# Altium project Course6.PrjPcb
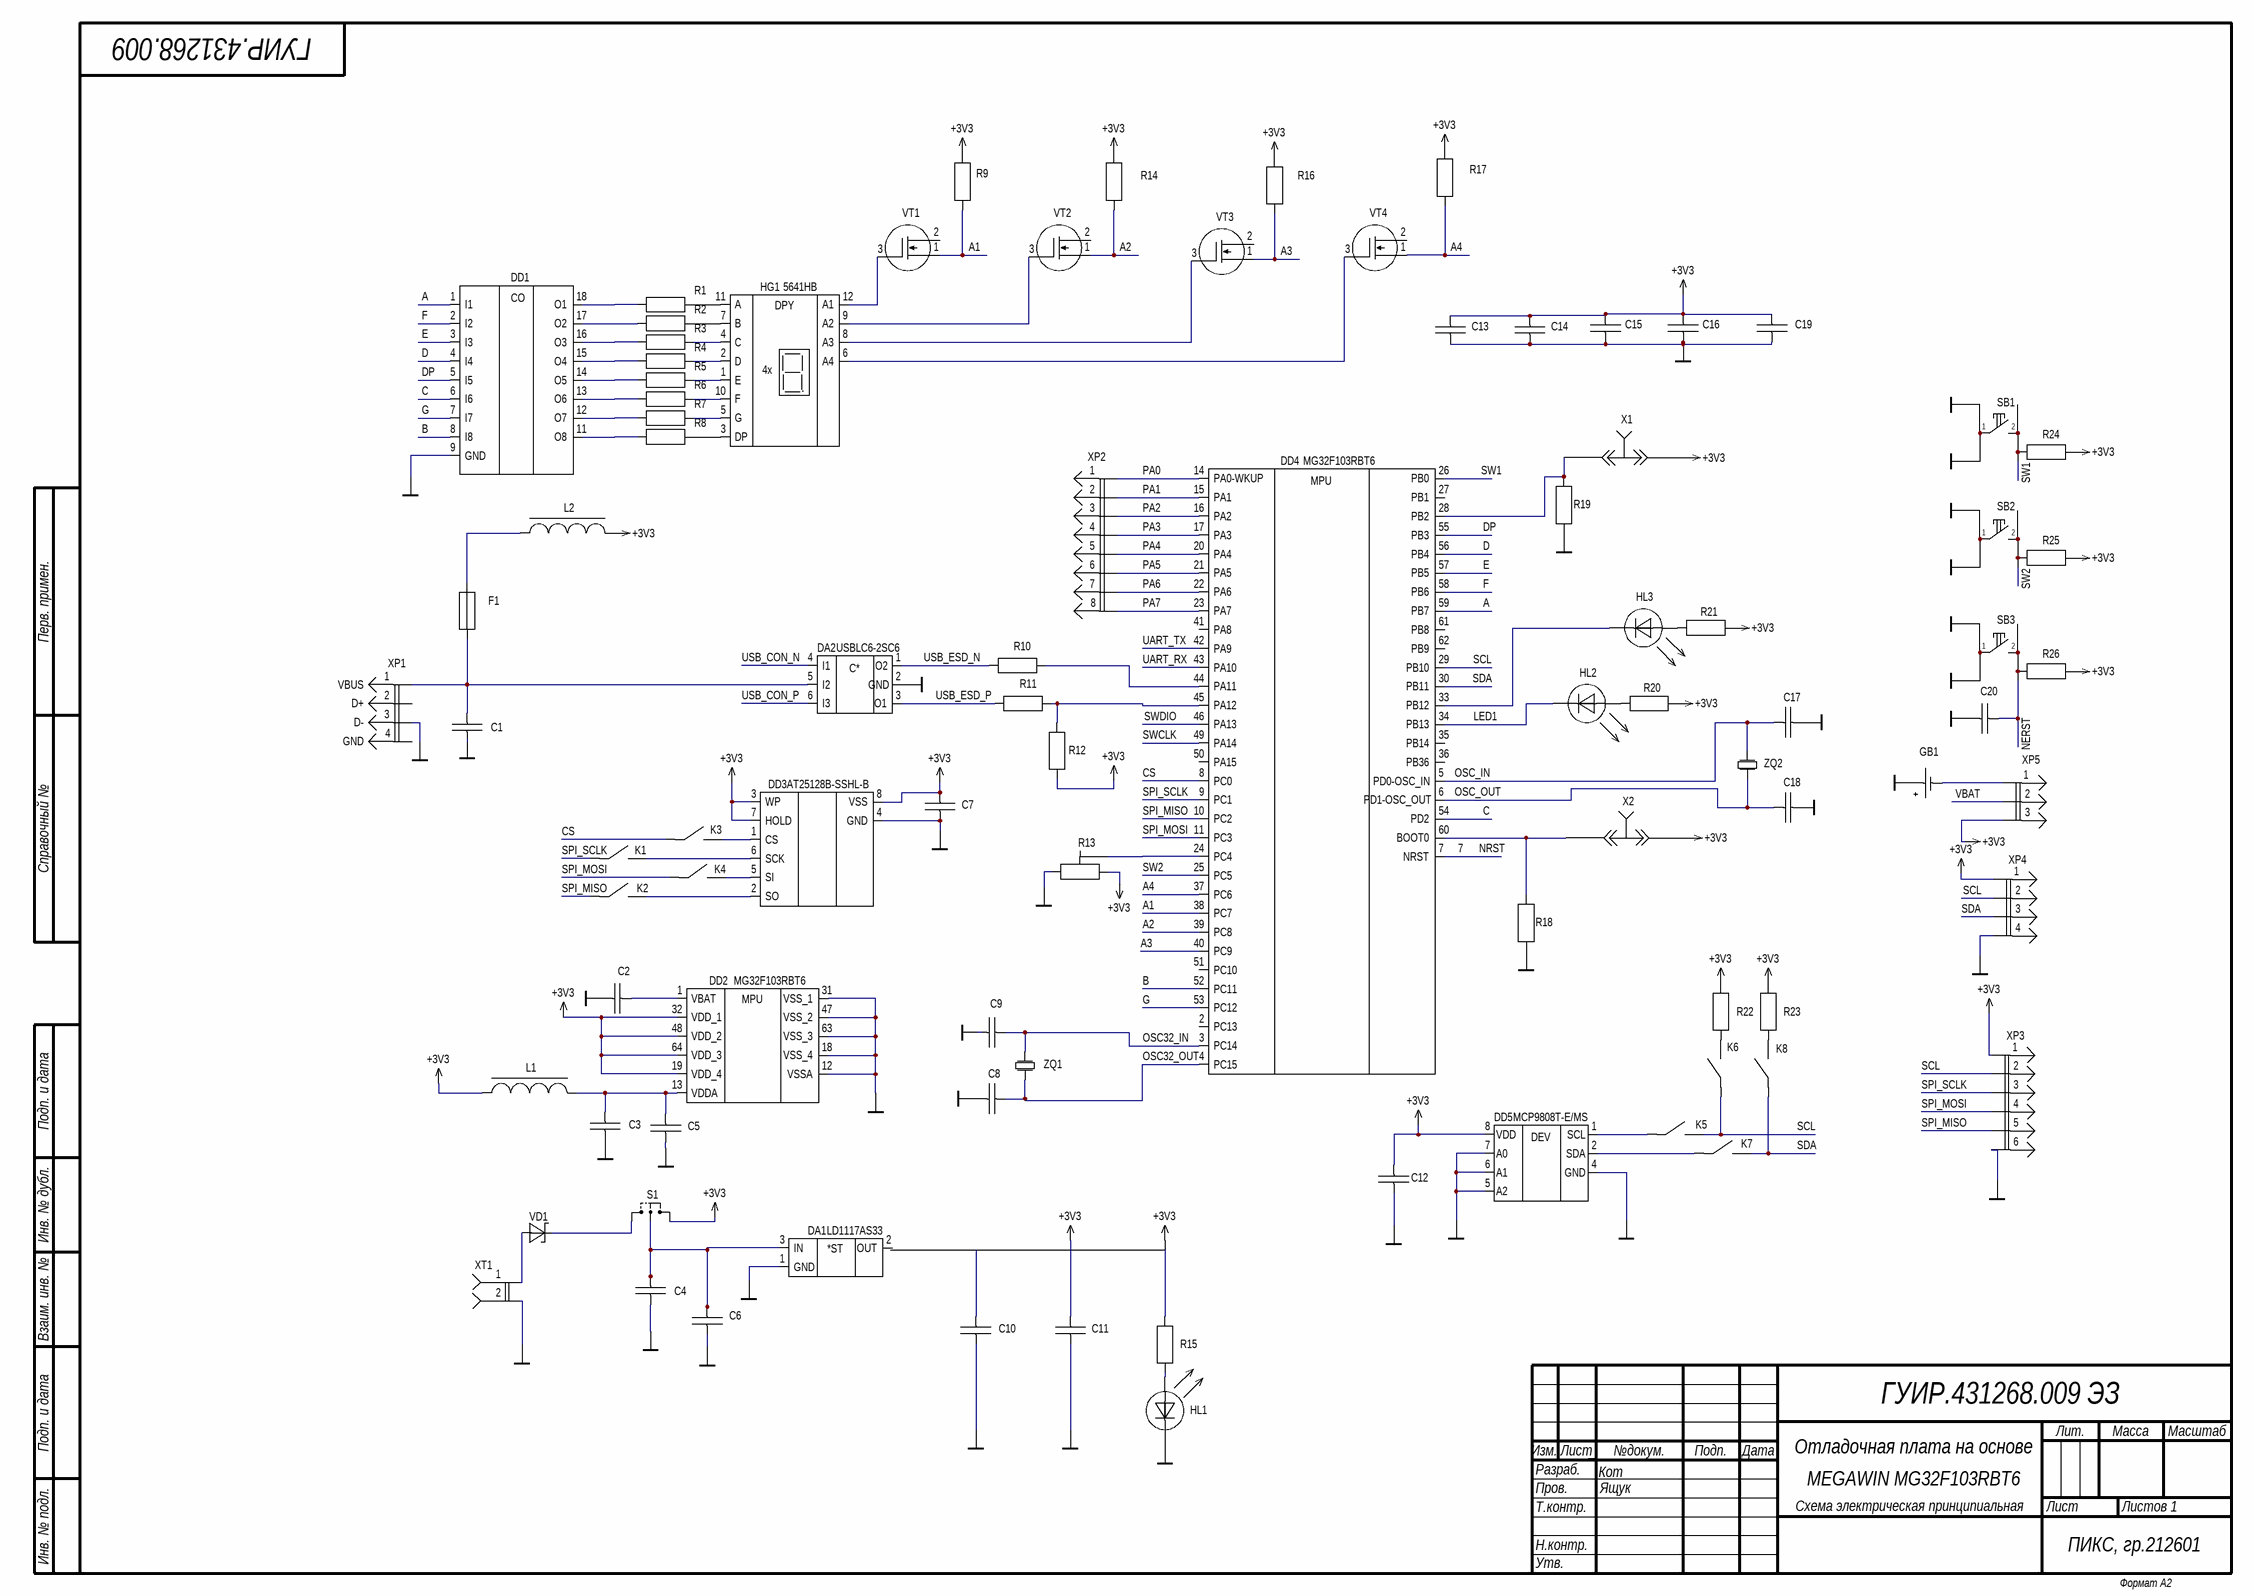
[diagram p0: Sheet1.SchDoc]
3 sheets, 88 parts. Net scope: global (net labels, ports and power ports of the same name join across sheets).
Sheets:
  Sheet1.SchDoc
  Sheet2.SchDoc
  Sheet3.SchDoc

## Sheet Sheet1.SchDoc
size 594 x 420 mm; SheetNumber: 1; SheetTotal: 3; _Oboznachenie: АБВГ.123456.789Э3; _Tip_dokumenta: Схема электрическая принципиальная; _Dopolnitelnye_grafy: -; DocumentName: Sheet1.SCHDOC

### Parts
C1  C  [C_0603]  (value not drawn)
C2  C  [C_0603]  (value not drawn)
C3  C  [C_0603]  (value not drawn)
C4  C  [C_0603]  (value not drawn)
C5  C  [C_0603]  (value not drawn)
C6  C  [C_0603]  (value not drawn)
C7  C  [C_0603]  (value not drawn)
C8  C  [C_0603]  (value not drawn)
C9  C  [C_0603]  (value not drawn)
C10  C  [C_0603]  (value not drawn)
C11  C  [C_0603]  (value not drawn)
C12  C  [C_0603]  (value not drawn)
C13  C  [C_0603]  (value not drawn)
C14  C  [C_0603]  (value not drawn)
C15  C  [C_0603]  (value not drawn)
C16  C  [C_0603]  (value not drawn)
C17  C  [C_0603]  (value not drawn)
C18  C  [C_0603]  (value not drawn)
C19  C  [C_0603]  (value not drawn)
C20  C  [C_0603]  (value not drawn)
DA1  LD1117AS33
DA2  USBLC6-2SC6
DD1  IC1  (value not drawn)
DD2  MG32F103RBT6
DD3  AT25128B-SSHL-B
DD4  MG32F103RBT6
DD5  MCP9808T-E/MS
F1  R_2_  (value not drawn)
GB1  С_pol  (value not drawn)
HG1  5641HB
HL1  H_LED  [LED]  (value not drawn)
HL2  H_LED  [LED]  (value not drawn)
HL3  H_LED  [LED]  (value not drawn)
K1  K  [RALAY 4PIN]  (value not drawn)
K2  K  [RALAY 4PIN]  (value not drawn)
K3  K  [RALAY 4PIN]  (value not drawn)
K4  K  [RALAY 4PIN]  (value not drawn)
K5  K  [RALAY 4PIN]  (value not drawn)
K6  K->  (value not drawn)
K7  K  [RALAY 4PIN]  (value not drawn)
K8  K->  (value not drawn)
L1  L_1  [C_0603]  (value not drawn)
L2  L_1  [C_0603]  (value not drawn)
R1  R  [R_0402]  (value not drawn)
R2  R  [R_0402]  (value not drawn)
R3  R  [R_0402]  (value not drawn)
R4  R  [R_0402]  (value not drawn)
R5  R  [R_0402]  (value not drawn)
R6  R  [R_0402]  (value not drawn)
R7  R  [R_0402]  (value not drawn)
R8  R  [R_0402]  (value not drawn)
R9  R  [R_0402]  (value not drawn)
R10  R  [R_0402]  (value not drawn)
R11  R  [R_0402]  (value not drawn)
R12  R  [R_0402]  (value not drawn)
R13  R-\  (value not drawn)
R14  R  [R_0402]  (value not drawn)
R15  R  [R_0402]  (value not drawn)
R16  R  [R_0402]  (value not drawn)
R17  R  [R_0402]  (value not drawn)
R18  R  [R_0402]  (value not drawn)
R19  R  [R_0402]  (value not drawn)
R20  R  [R_0402]  (value not drawn)
R21  R  [R_0402]  (value not drawn)
R22  R  [R_0402]  (value not drawn)
R23  R  [R_0402]  (value not drawn)
R24  R  [R_0402]  (value not drawn)
R25  R  [R_0402]  (value not drawn)
R26  R  [R_0402]  (value not drawn)
S1  S  (value not drawn)
SB1  SB  [Pushbutton Switch]  (value not drawn)
SB2  SB  [Pushbutton Switch]  (value not drawn)
SB3  SB  [Pushbutton Switch]  (value not drawn)
VD1  VD_SHOTKI  [DIODE]  (value not drawn)
VT1  BSS84  (value not drawn)
VT2  BSS84  (value not drawn)
VT3  BSS84  (value not drawn)
VT4  BSS84  (value not drawn)
X1  X  (value not drawn)
X2  X  (value not drawn)
XP1  J1  (value not drawn)
XP2  XP  (value not drawn)
XP3  SPI  (value not drawn)
XP4  XP4  (value not drawn)
XP5  XPP  (value not drawn)
XT1  XT_2  [3PIN CON]  (value not drawn)
ZQ1  Z  (value not drawn)
ZQ2  Z  (value not drawn)

### Nets
+3V3: C7.1 C11.2 C12.1 C13.1 C14.1 C15.1 C16.1 C19.1 DD2.19(VDD_4) DD2.32(VDD_1) DD2.48(VDD_2) DD2.64(VDD_3) DD3.3(WP) DD3.7(HOLD) DD3.8(VSS) DD5.8(VDD) L1.1 L2.2 R9.1 R12.1 R13.2 R14.1 R16.1 R17.1 R20.1 R21.1 R22.2 R23.2 R24.2 R25.2 R26.2 X1.1 X2.1 XP3.1(RES) XP4.1(RES) XP5.3(Общ.)
GND: C1.1 C3.2 C4.1 C5.2 C6.1 C7.2 C8.2 C9.2 C10.1 C11.1 C12.2 C13.2 C14.2 C15.2 C16.2 C17.2 C19.2 C20.1 DA1.1(GND) DA2.2(GND) DD1.9(GND) DD2.12(VSSA) DD2.18(VSS_4) DD2.31(VSS_1) DD2.47(VSS_2) DD2.63(VSS_3) DD3.4(GND) DD5.4(GND) DD5.5(A2) DD5.6(A1) DD5.7(A0) GB1.2 HL1.2(C) R13.1 R18.2 R19.2 SB1.1 SB2.1 SB3.1 XP1.3(D-) XP3.6(PGD) XP4.4(PGC) XT1.2
A: DD1.1(I1) DD4.59(PB7)
A1: DD4.38(PC7) R9.2 VT1.1
A2: DD4.39(PC8) R14.2 VT2.1
A3: DD4.40(PC9) R16.2 VT3.1
A4: DD4.37(PC6) R17.2 VT4.1
B: DD1.8(I8) DD4.52(PC11)
C: DD1.6(I6) DD4.54(PD2)
CS: DD4.8(PC0) K3.1
D: DD1.4(I4) DD4.56(PB4)
DP: DD1.5(I5) DD4.55(PB3)
E: DD1.3(I3) DD4.57(PB5)
F: DD1.2(I2) DD4.58(PB6)
G: DD1.7(I7) DD4.53(PC12)
LED1: DD4.34(PB13) HL2.2(C)
NERST: C20.2 R26.1 SB3.2
NRST: DD4.7(NRST)
OSC32_IN: C9.1 DD4.3(PC14) ZQ1.1(X1)
OSC32_OUT: C8.1 DD4.4(PC15) ZQ1.2(X2)
OSC_IN: C17.1 DD4.5(PD0-OSC_IN) ZQ2.2(X2)
OSC_OUT: C18.1 DD4.6(PD1-OSC_OUT) ZQ2.1(X1)
PA0: DD4.14(PA0-WKUP) XP2.1(PGD)
PA1: DD4.15(PA1) XP2.2(PGD)
PA2: DD4.16(PA2) XP2.3(PGD)
PA3: DD4.17(PA3) XP2.4(PGD)
PA4: DD4.20(PA4) XP2.5(PGC)
PA5: DD4.21(PA5) XP2.6(Общ.)
PA6: DD4.22(PA6) XP2.7(+5_B)
PA7: DD4.23(PA7) XP2.8(RES)
SCL: DD4.29(PB10) K5.2 K6.1 XP3.2(+5_B) XP4.2(+5_B)
SDA: DD4.30(PB11) K7.2 K8.1 XP4.3(Общ.)
SPI_MISO: DD4.10(PC2) K2.1 XP3.5(PGD)
SPI_MOSI: DD4.11(PC3) K4.1 XP3.4(PGC)
SPI_SCLK: DD4.9(PC1) K1.1 XP3.3(Общ.)
SW1: DD4.26(PB0) R24.1 SB1.2
SW2: DD4.25(PC5) R25.1 SB2.2
SWCLK: DD4.49(PA14)
SWDIO: DD4.46(PA13)
UART_RX: DD4.43(PA10)
UART_TX: DD4.42(PA9)
USB_CON_N: DA2.4(I1)
USB_CON_P: DA2.6(I3)
USB_ESD_N: DA2.1(O2) R10.2
USB_ESD_P: DA2.3(O1) R11.2
VBAT: XP5.2(+5_B)
NetC1_2: C1.2 DA2.5(I2) F1.1 XP1.1(VBUS)
NetC2_2: C2.2 DD2.1(VBAT)
NetC3_1: C3.1 C5.1 DD2.13(VDDA) L1.2
NetC4_2: C4.2 C6.2 DA1.3(IN)
NetDD1_11: DD1.11(O8) R8.1
NetDD1_12: DD1.12(O7) R7.1
NetDD1_13: DD1.13(O6) R6.1
NetDD1_14: DD1.14(O5) R5.1
NetDD1_15: DD1.15(O4) R4.1
NetDD1_16: DD1.16(O3) R3.1
NetDD1_17: DD1.17(O2) R2.1
NetDD1_18: DD1.18(O1) R1.1
NetDD3_1: DD3.1(CS) K3.2
NetDD3_2: DD3.2(SO) K2.2
NetDD3_5: DD3.5(SI) K4.2
NetDD3_6: DD3.6(SCK) K1.2
NetDD4_24: DD4.24(PC4) R13.2
NetDD4_28: DD4.28(PB2) R19.1 X1.1
NetDD4_33: DD4.33(PB12) HL3.2(C)
NetDD4_44: DD4.44(PA11) R10.1
NetDD4_45: DD4.45(PA12) R11.1 R12.2
NetDD4_60: DD4.60(BOOT0) R18.1 X2.1
NetDD5_1: DD5.1(SCL) K5.1
NetDD5_2: DD5.2(SDA) K7.1
NetF1_2: F1.2 L2.1
NetGB1_1: GB1.1 XP5.1(RES)
NetHG1_1: HG1.1(E) R5.2
NetHG1_2: HG1.2(D) R4.2
NetHG1_3: HG1.3(DP) R8.2
NetHG1_4: HG1.4(C) R3.2
NetHG1_5: HG1.5(G) R7.2
NetHG1_6: HG1.6(A4) VT4.3
NetHG1_7: HG1.7(B) R2.2
NetHG1_8: HG1.8(A3) VT3.3
NetHG1_9: HG1.9(A2) VT2.3
NetHG1_10: HG1.10(F) R6.2
NetHG1_11: HG1.11(A) R1.2
NetHG1_12: HG1.12(A1) VT1.3
NetHL1_1: HL1.1(A) R15.1
NetHL2_1: HL2.1(A) R20.2
NetHL3_1: HL3.1(A) R21.2
NetK6_2: K6.2 R22.1
NetK8_2: K8.2 R23.1
NetVD1_1: VD1.1 XT1.1

Not connected (* = marked no-connect by the designer): C2 1; C10 2; C18 2; DA1 2(OUT); DD4 2(PC13) 27(PB1) 35(PB14) 36(PB36) 41(PA8) 50(PA15) 51(PC10) 61(PB8) 62(PB9); R15 2; VD1 2; VT1 2; VT2 2; VT3 2; VT4 2; XP1 2(D+) 4(GND)

### Notes on the sheet
- (near DD1) CO
- (near DD4) 7
- (near DD2) MPU
- Labels drawn without touching a wire or pin: +3V3, GND
- ГУИР.431268.009
- Перв. примен.
- Справочный №
- Подп. и дата
- Инв. № дубл.
- Взаим. инв. №
- ГУИР.431268.009 ЭЗ
- Разраб.
- Изм.
- Лист
- Кот
- №докум.
- Подп.
- Дата
- Отладочная плата на основе
- Лит.
- Масса
- Масштаб
- Пров.
- Т.контр.
- Ящук
- Схема электрическая принципиальная
- MEGAWIN MG32F103RBT6
- Листов 1
- Инв. № подл.
- Н.контр.
- Утв.
- ПИКС, гр.212601
- Формат A2
- (in symbol LED) DPY; DPY / LED; 4x; .
- (in symbol U1) *ST
- (in symbol U2) Type @ to refer to a designator or a net; C*
- (in symbol U3) MPU /
- (in symbol U4) *T
- (in symbol U5) DEV

### Library data of the parts
C1-C20 = C: Конденсатор
DA1 = U1
DA2 = U2
DD2 = U3B
DD3 = U4
DD4 = U3
DD5 = U5
F1 = R_2_: Резистор
GB1 = С_pol: Конденсатор полярный
HG1 = LED
HL1-HL3 = H_LED: Диод
K1-K5 K7 = K: Реле
L1 L2 = L_1: Индуктивность с ферромагнетиком
R1-R12 R14-R26 = R: Резистор
R13 = R-\: Резистор (подстрооечный)
SB1-SB3 = SB: Кнопка
VD1 = VD_SHOTKI: Диод Шоттки
VT1-VT4 = Q
XP2 = PA
XT1 = XT_2: Соединение (розетка)
ZQ1 ZQ2 = Z: Резонатор кварцевый

## Sheet Sheet2.SchDoc
size 209 x 297 mm; SheetNumber: 2; SheetTotal: 3
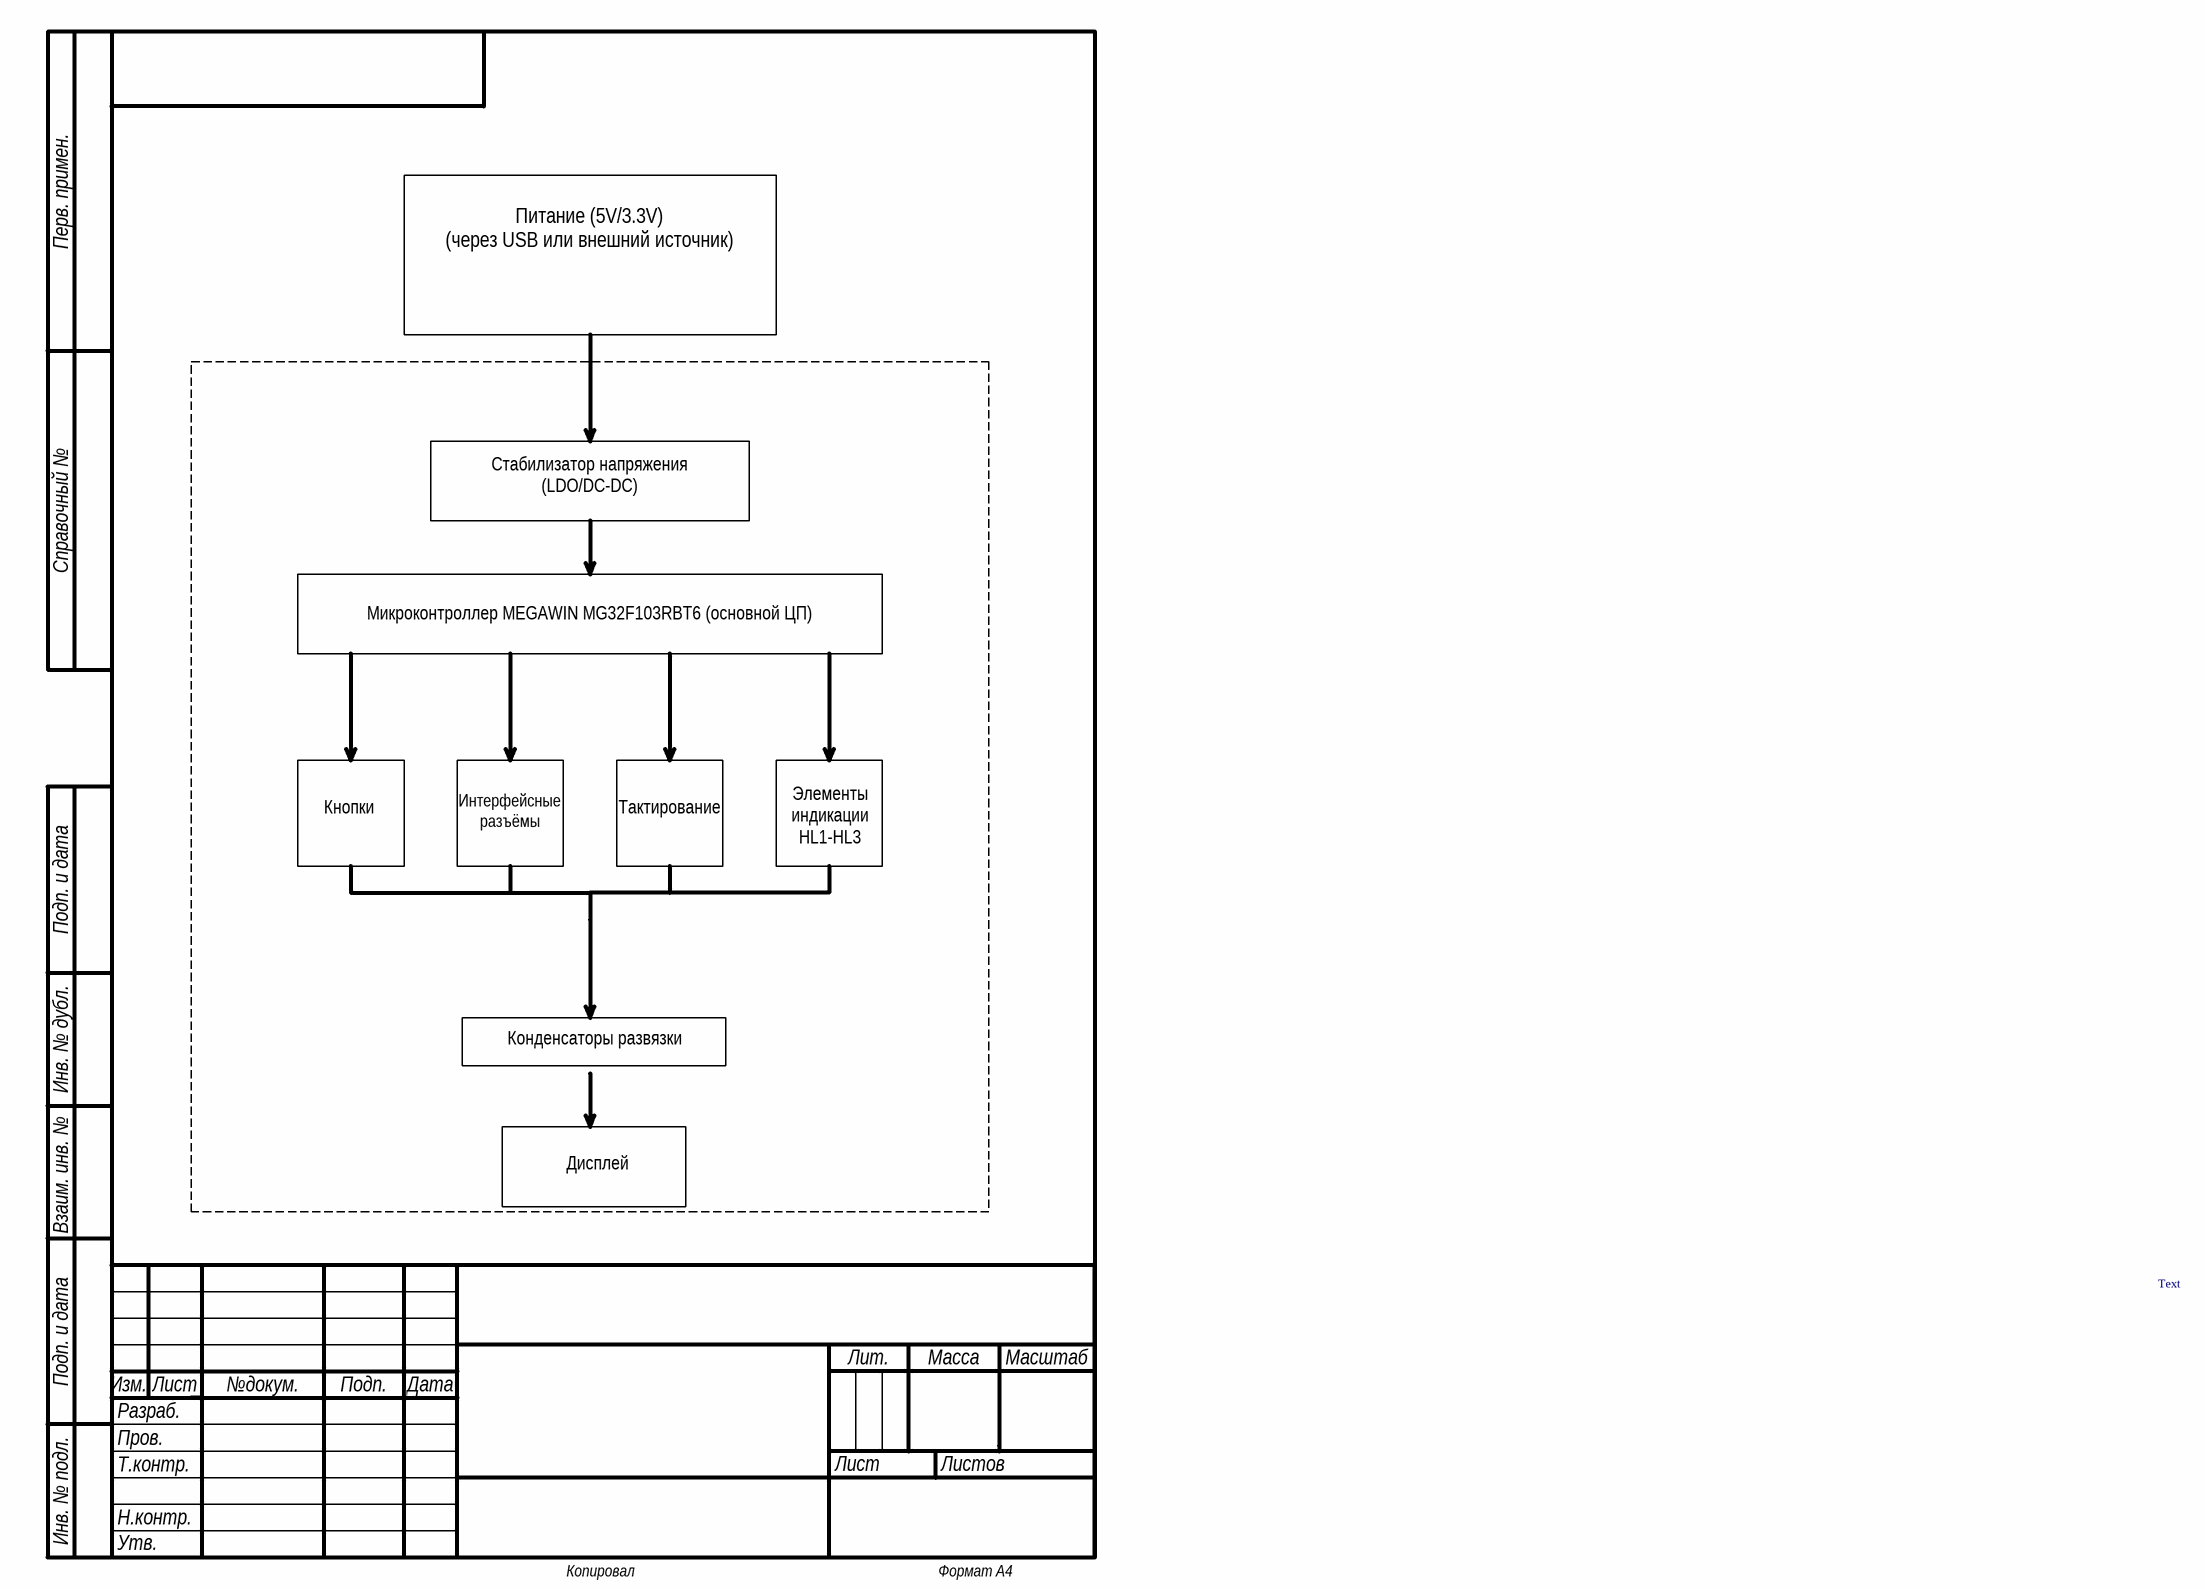
[diagram p1: Sheet2.SchDoc]

### Notes on the sheet
- Питание (5V/3.3V)                                                (через USB или внешний источник)
- Стабилизатор напряжения (LDO/DC-DC)
- Микроконтроллер MEGAWIN MG32F103RBT6 (основной ЦП)
- Кнопки
- Интерфейсные разъёмы
- Тактирование ZQ1, ZQ2
- Элементы индикации HL1-HL3
- Конденсаторы развязки
- Дисплей
- Text
- Перв. примен.
- Справочный №
- Подп. и дата
- Инв. № дубл.
- Взаим. инв. №
- Разраб.
- Изм.
- Лист
- №докум.
- Подп.
- Дата
- Лит.
- Масса
- Масштаб
- Пров.
- Т.контр.
- Листов
- Инв. № подл.
- Н.контр.
- Утв.
- Копировал
- Формат A4

## Sheet Sheet3.SchDoc
size 209 x 297 mm; SheetNumber: 3; SheetTotal: 3
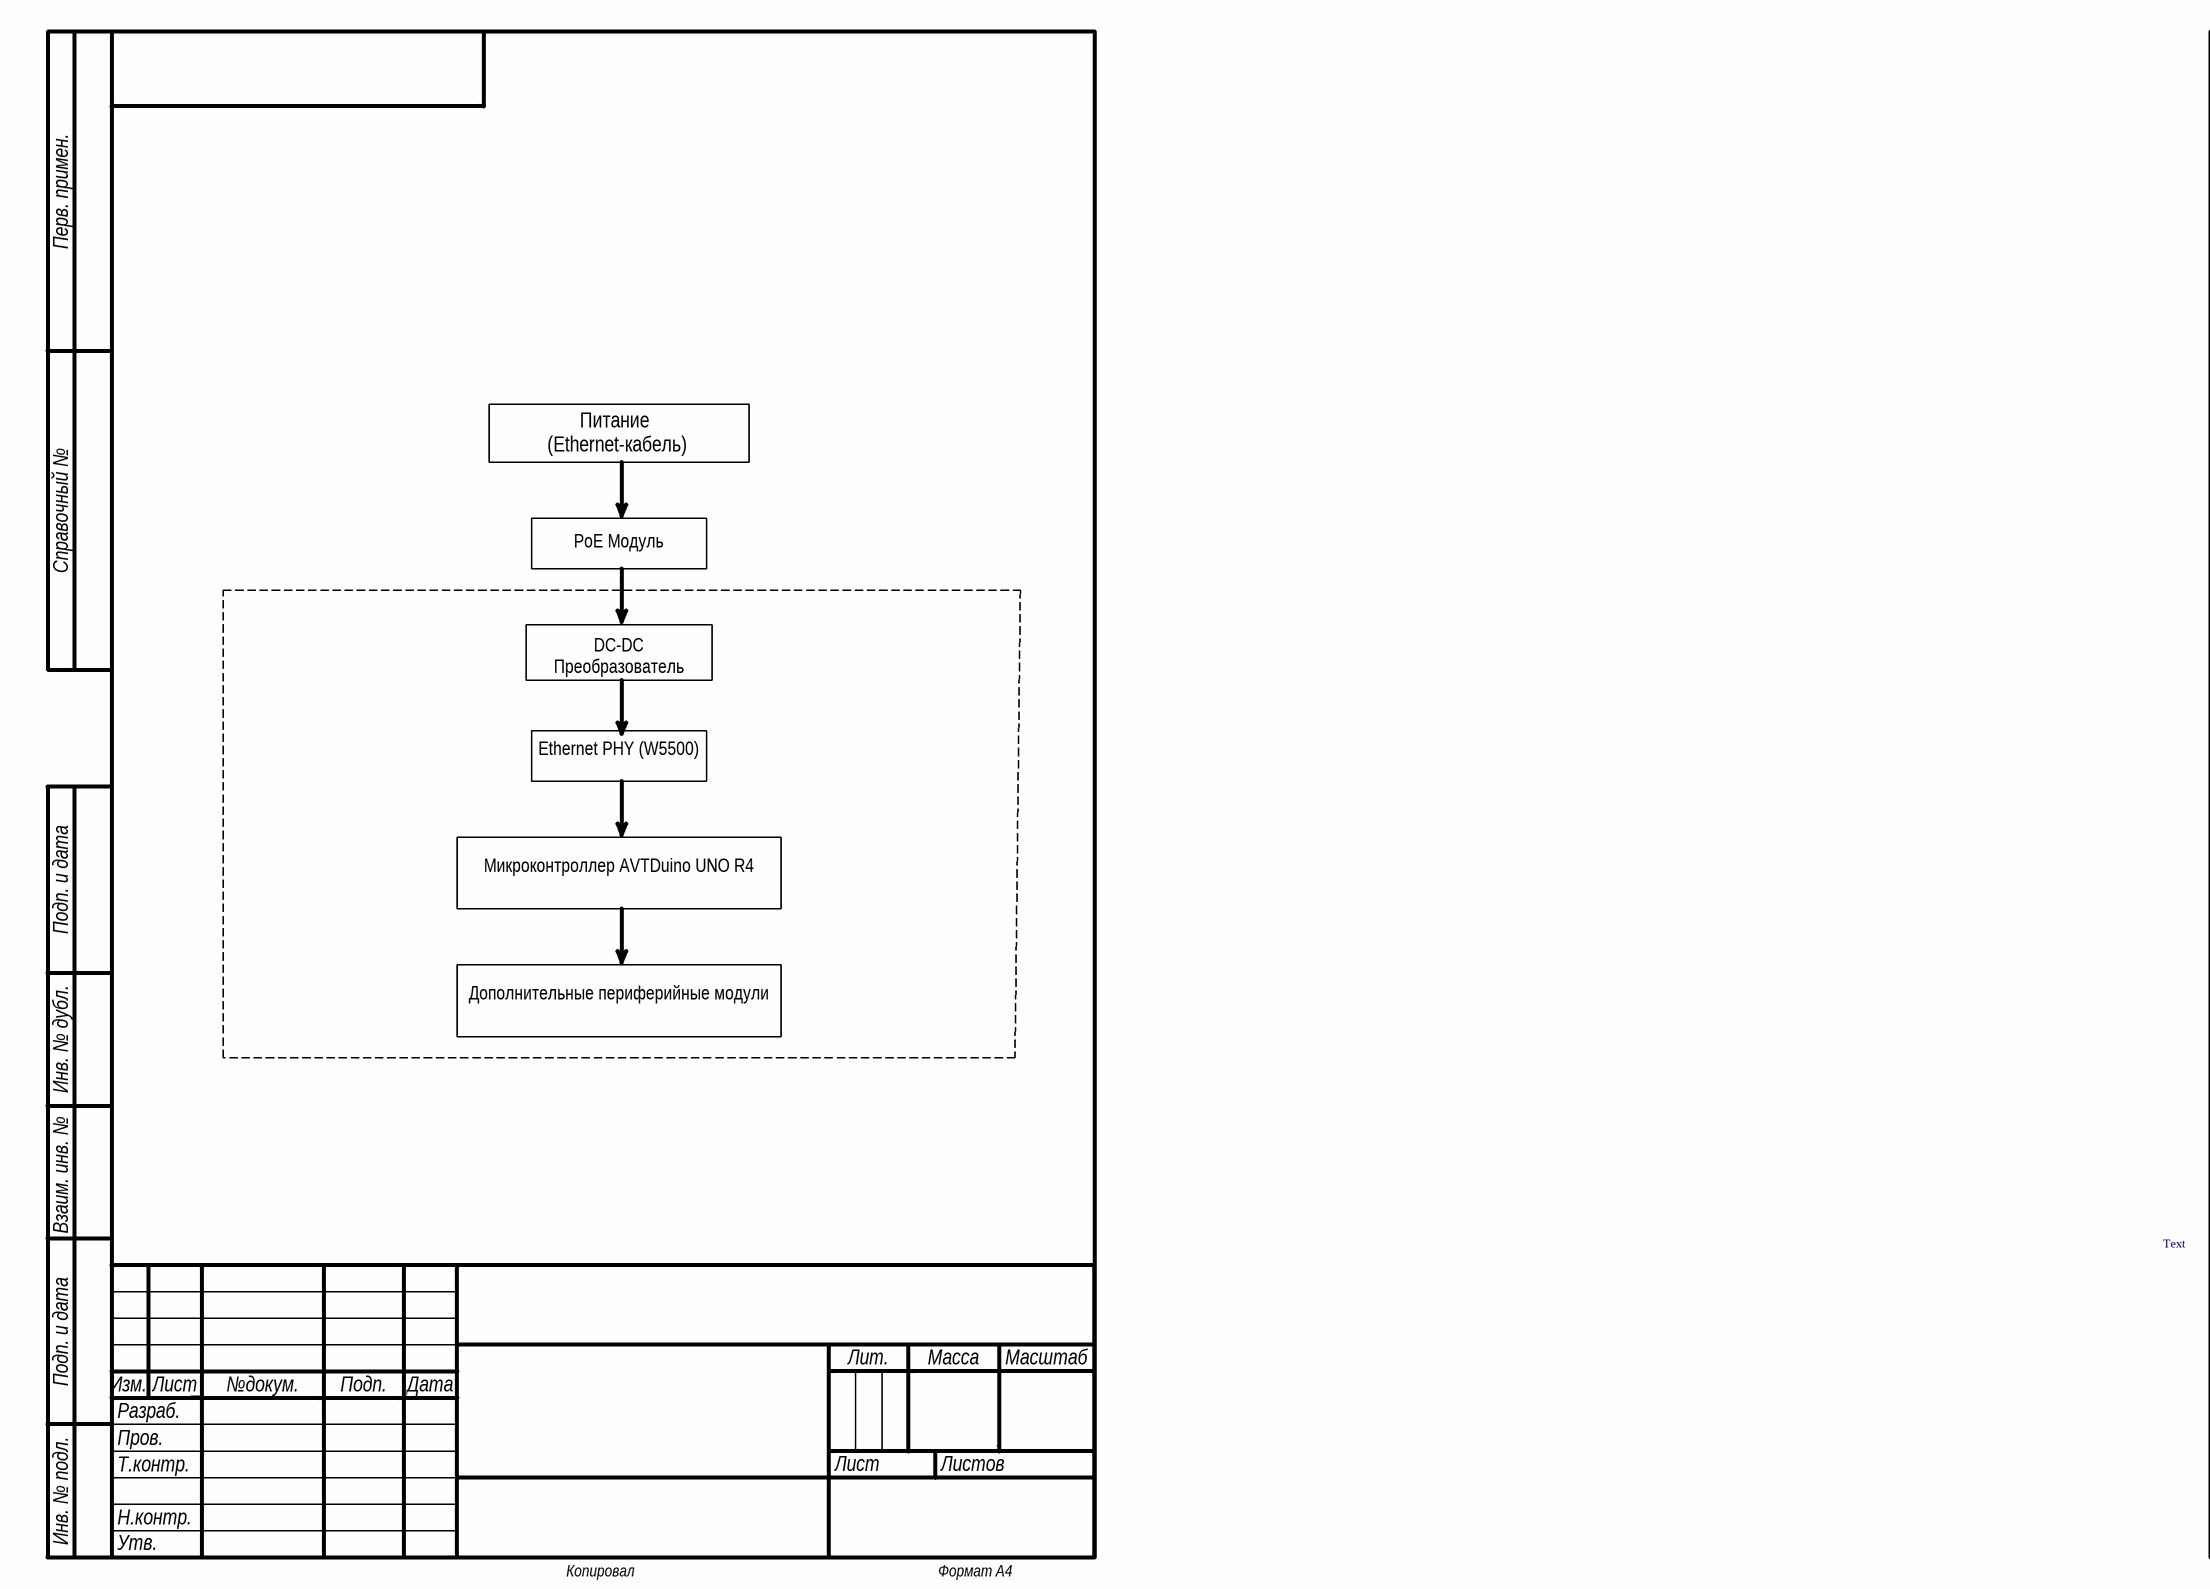
[diagram p2: Sheet3.SchDoc]

### Notes on the sheet
- Питание
  (Ethernet-кабель)
- PoE Модуль
- DC-DC Преобразователь
  (12V-5V)
- Ethernet PHY (W5500)
- Микроконтроллер AVTDuino UNO R4 PLUS
- Дополнительные периферийные модули
- Text
- Перв. примен.
- Справочный №
- Подп. и дата
- Инв. № дубл.
- Взаим. инв. №
- Разраб.
- Изм.
- Лист
- №докум.
- Подп.
- Дата
- Лит.
- Масса
- Масштаб
- Пров.
- Т.контр.
- Листов
- Инв. № подл.
- Н.контр.
- Утв.
- Копировал
- Формат A4